# EAGLE schematic main (EAGLE 8.3.0)
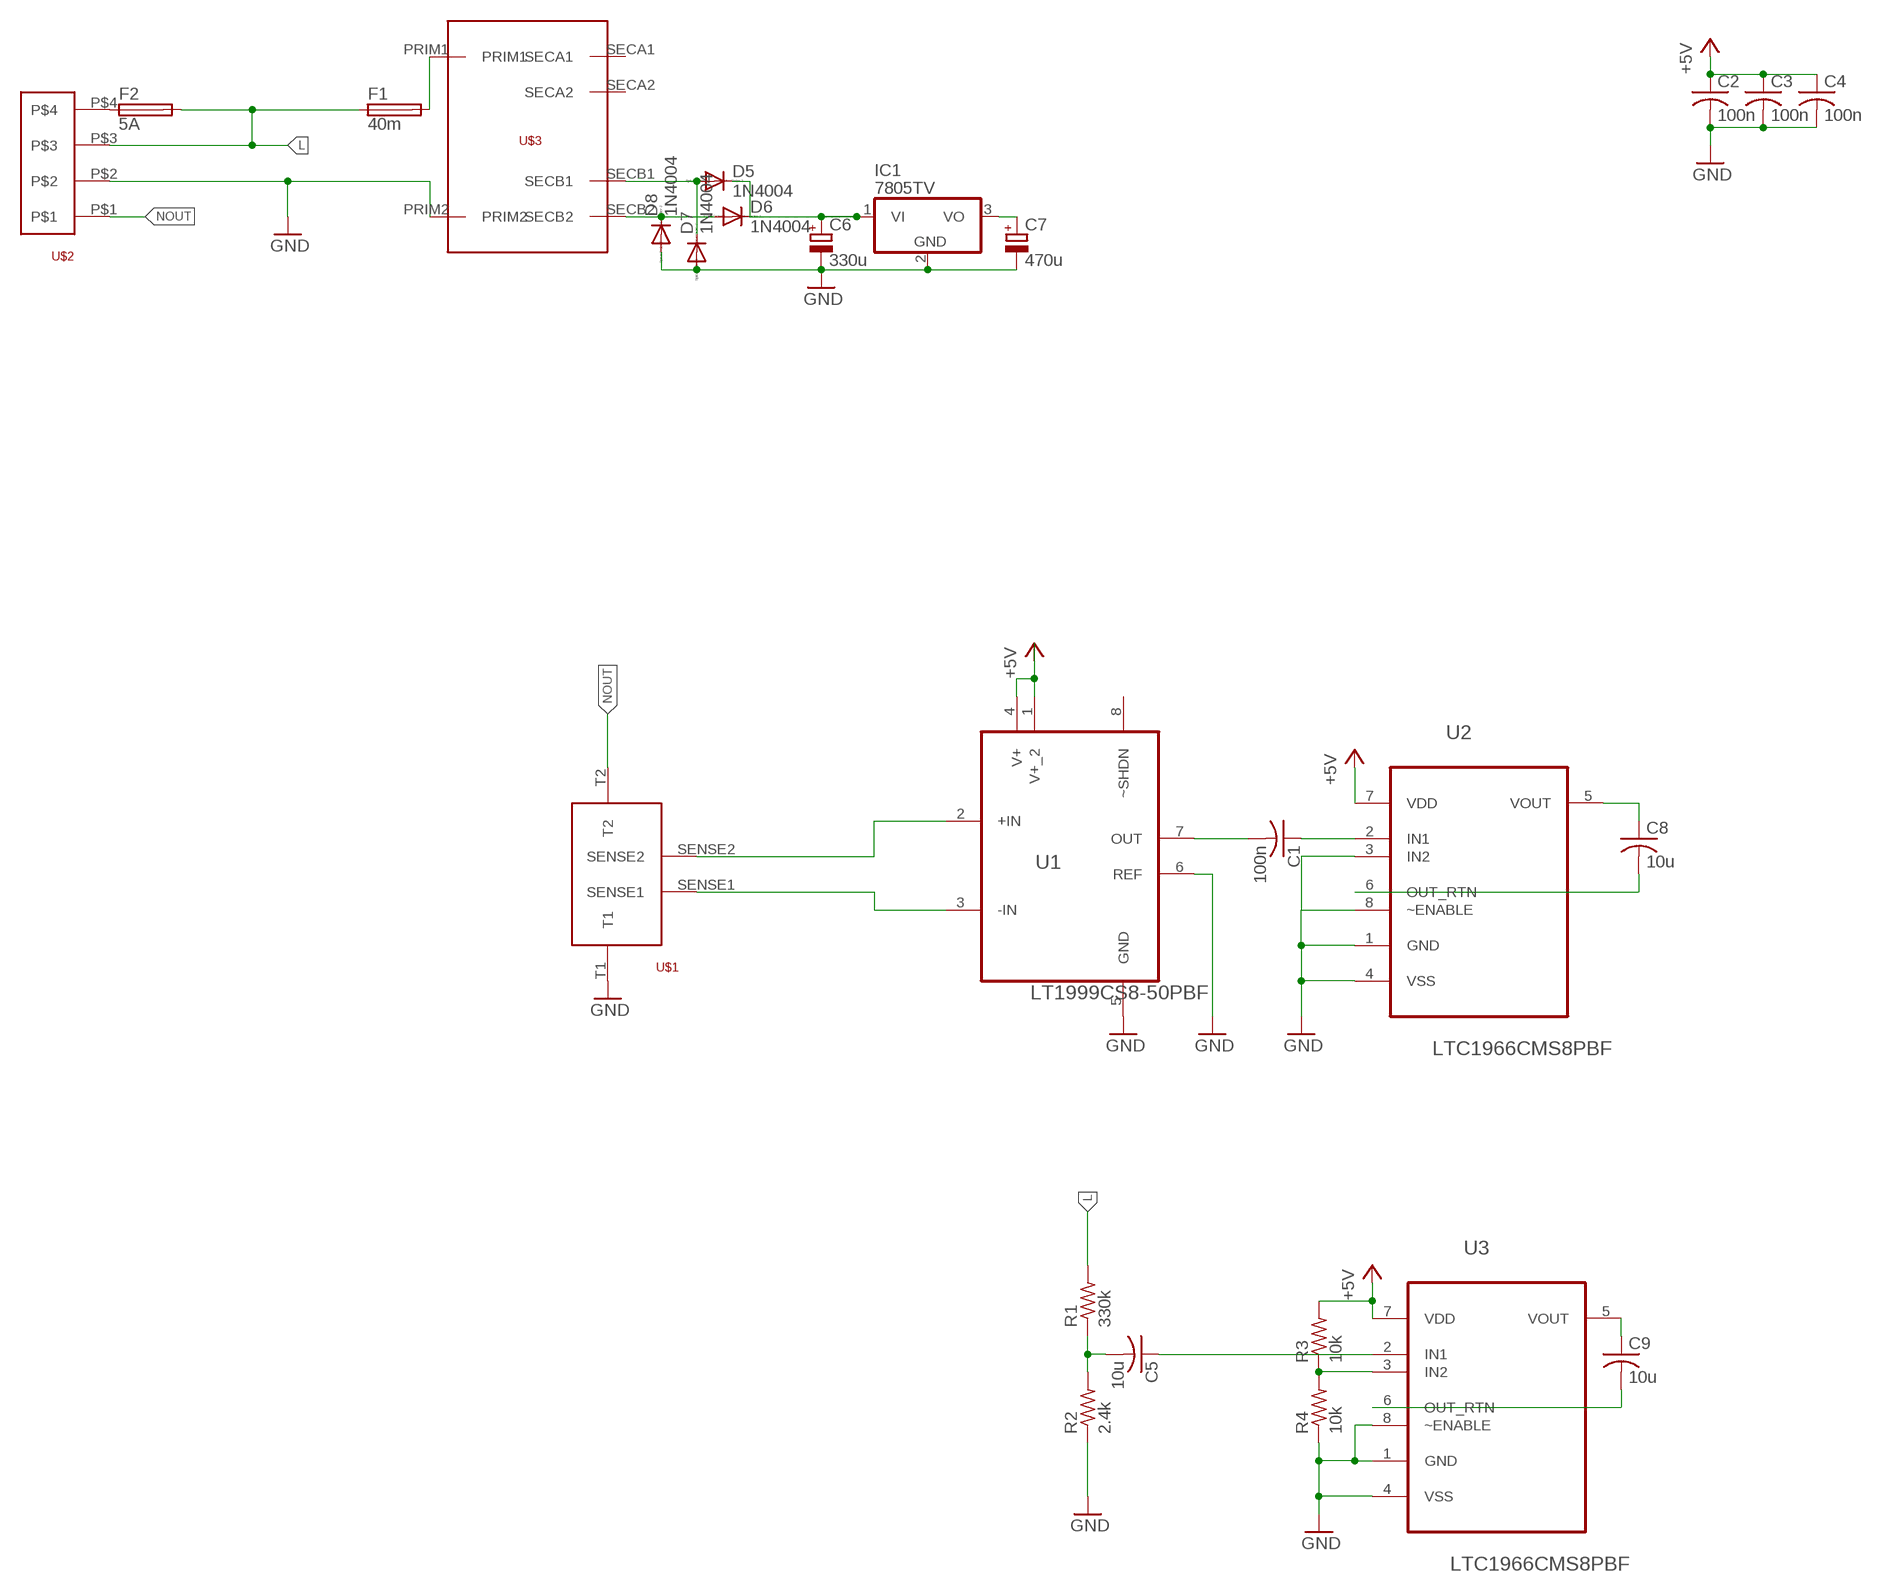
[diagram p0: schematic, sheet 1]

## Parts
C1  100n  C-USC0603  [C0603]
C2  100n  C-USC0603  [C0603]
C3  100n  C-USC0603  [C0603]
C4  100n  C-USC0603  [C0603]
C5  10u  C-USC0603  [C0603]
C6  330u  CPOL-EUE3.5-10  [E3,5-10]
C7  470u  CPOL-EUE3.5-10  [E3,5-10]
C8  10u  C-USC0603  [C0603]
C9  10u  C-USC0603  [C0603]
D5  1N4004  [DO41-10]
D6  1N4004  [DO41-10]
D7  1N4004  [DO41-10]
D8  1N4004  [DO41-10]
F1  40m  SH22,5  [SH22,5]
F2  5A  SH22,5  [SH22,5]
IC1  7805TV  [TO220V]
R1  330k  R-US_0207/12  [0207/12]
R2  2.4k  R-US_0207/12  [0207/12]
R3  10k  R-US_0207/12  [0207/12]
R4  10k  R-US_0207/12  [0207/12]
U1  LT1999CS8-50PBF  [SOIC127P600X175-8N]
U2  LTC1966CMS8PBF  [SOP65P490X110-8N]
U3  LTC1966CMS8PBF  [SOP65P490X110-8N]
U$1  CSR2TTE30L0F  [CSR2TTE30L0F]
U$2  SCREWTERM_5MM_4WAY  [SCREWTERM_5MM_4WAY]
U$3  GAL3515E-WDB-01  [GAL3515E-WDB-01]

## Nets
+5V: C2.1 C3.1 C4.1 R3.2 U1.1(V+_2) U1.4(V+) U2.7(VDD) U3.7(VDD)
GND: C2.2 C3.2 C4.2 C6.- C7.- D7.A D8.A IC1.2(GND) R2.1 U1.5(GND) U1.6(REF) U2.1(GND) U2.3(IN2) U2.4(VSS) U2.8(~ENABLE) U3.1(GND) U3.4(VSS) U3.8(~ENABLE) U$1.T1 U$2.P$2 U$3.PRIM2
L: F1.1 F2.2 R1.2 U$2.P$3
N$1: U1.2(+IN) U$1.SENSE2
N$2: U1.3(-IN) U$1.SENSE1
N$3: C1.2 U1.7(OUT)
N$4: C1.1 U2.2(IN1)
N$5: R3.1 R4.2 U3.3(IN2)
N$6: C5.1 U3.2(IN1)
N$7: D5.A D7.C U$3.SECB1
N$8: C7.+ IC1.3(VO)
N$9: C8.2 U2.6(OUT_RTN)
N$10: C8.1 U2.5(VOUT)
N$11: D6.A D8.C U$3.SECB2
N$12: C5.2 R1.1 R2.2
N$13: C6.+ D5.C D6.C IC1.1(VI)
N$14: C9.2 U3.6(OUT_RTN)
N$15: C9.1 U3.5(VOUT)
N$16: F1.2 U$3.PRIM1
N$17: F2.1 U$2.P$4
NOUT: U$1.T2 U$2.P$1
Unconnected: R4.1 U1.8(~SHDN) U$3.SECA1 U$3.SECA2

## Library data of the parts
C1-C5 C8 C9 = resistor:C-US: CAPACITOR, American symbol
C6 C7 = resistor:CPOL-EU: POLARIZED CAPACITOR, European symbol
D5-D8 = diode:1N4004: DIODE general purpose rectifier, 1 A
F1 F2 = fuse:SH22,5: FUSE HOLDER grid 22,5 mm, OGN0031 8201, Schurter (Buerklin); MF: SCHURTER; MPN: 0031.8201; OC_FARNELL: 1162740; OC_NEWARK: 96F8317
IC1 = linear:78*: Positive VOLTAGE REGULATOR Source: http://cache.national.com/ds/LM/LM78L05.pdf http://www.fairchildsemi.com/ds/LM/LM7805.pdf
R1-R4 = resistor:R-US_: RESISTOR, American symbol
U1 = LTC_By_element14_Batch_1:LT1999CS8-50PBF: High Voltage, Bidirectional Current Sense Amplifier; MPN: LT1999CS8-50#PBF; OC_FARNELL: 1868097; OC_NEWARK: 24T0472; PACKAGE: SOIC-8; SUPPLIER: LINEAR TECHNOLOGY
U2 U3 = LTC_By_element14_Batch_1:LTC1966CMS8PBF: Precision Micropower, DS RMS-to-DC Converter; MPN: LTC1966CMS8#PBF; OC_FARNELL: 1330887; OC_NEWARK: 56M4388; PACKAGE: MSOP-8; SUPPLIER: Linear Technology
U$1 = 7_segment_lib:CSR2TTE30L0F
U$2 = 7_segment_lib:SCREWTERM_5MM_4WAY
U$3 = 7_segment_lib:GAL3515E-WDB-01